# Altium schematic sheet Secondary_Protector.SchDoc: =SheetTitle
size A4; SheetTitle: Secondary Battery Protections; DrawnBy: Samyar Sadat Akhavi; SheetNumber: 4; SheetTotal: 5
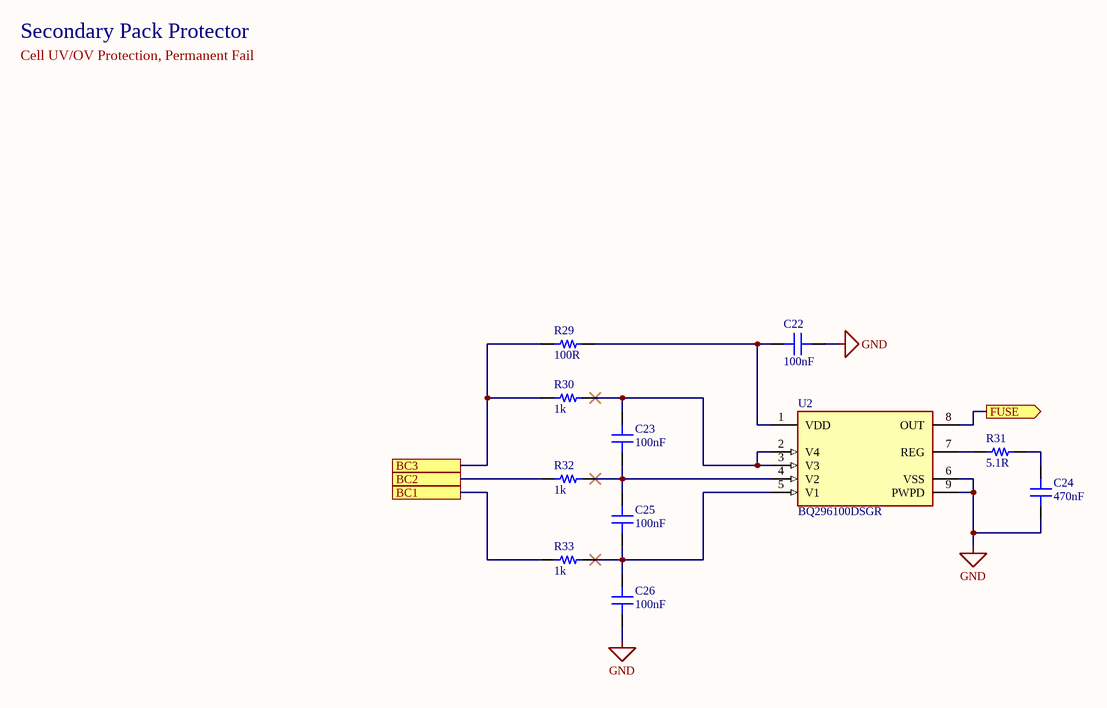
[diagram p0: Secondary_Protector.SchDoc]

## Parts
?  (no value)  (graphical)
C22  100nF  [CAP 0603_1608]
C23  100nF  [CAP 0603_1608]
C24  470nF  [CAP 0603_1608]
C25  100nF  [CAP 0603_1608]
C26  100nF  [CAP 0603_1608]
R29  100R  [RES 0603_1608]
R30  1k  [RES 0603_1608]
R31  5.1R  [RES 0603_1608]
R32  1k  [RES 0603_1608]
R33  1k  [RES 0603_1608]
U2  BQ296100DSGR  [DSG0008A]

## Ports
BC1 (see Pack_BMS_Module[2C], Battery_Management[1C], Cell_Connections[2B]), BC2 (see Pack_BMS_Module[2C], Battery_Management[1C], Cell_Connections[2B]), BC3 (see Pack_BMS_Module[2C], Battery_Management[1C], Cell_Connections[2B]), FUSE (out, see Pack_BMS_Module[2C], Battery_Management[3B])

## Nets
GND: C22.1 C24.1 C26.1 U2.6(VSS) U2.9(PWPD)
BC1: R33.1 ; port BC1
BC2: R32.1 ; port BC2
BC3: R29.2 R30.1 ; port BC3
FUSE: U2.8(OUT) ; port FUSE
NetC22_2: C22.2 R29.1 U2.1(VDD)
NetC23_1: C23.1 C25.2 R32.2 U2.4(V2)
NetC23_2: C23.2 R30.2 U2.2(V4) U2.3(V3)
NetC24_2: C24.2 R31.2
NetC25_1: C25.1 C26.2 R33.2 U2.5(V1)
NetR31_1: R31.1 U2.7(REG)

## Notes on the sheet
- Secondary Pack Protector
- Cell UV/OV Protection, Permanent Fail
- Sub-Project:
- Size:
- Drawn By:
- Revision:
- Date:
- File:
- Sheet:
- of

## Library data of the parts
? = SGR-STDTBSA4: STANDARD SCHEMATICS TITLE BLOCK
C22 C23 C25 C26 = GEN-CC100NT10V25KX7R603: GENERIC 0603 MLC CAPACITOR; Tolerance: ±10%; Voltage: 25V; Dielectric: X7R; Part Number: GEN-CC100NT10V25KX7R603; Value: 100nF
C24 = GEN-CC470NT10V16KX7R603: GENERIC 0603 MLC CAPACITOR; Tolerance: ±10%; Voltage: 16V; Dielectric: X7R; Part Number: GEN-CC470NT10V16KX7R603; Value: 470nF
R29 = GEN-CRR100T1P8603: GENERIC 0603 CHIP RESISTOR; Tolerance: ±1%; Power: 0.125W; Part Number: GEN-CRR100T1P8603; Value: 100R
R30 R32 R33 = GEN-CRR1KT1P8603: GENERIC 0603 CHIP RESISTOR; Tolerance: ±1%; Power: 0.125W; Part Number: GEN-CRR1KT1P8603; Value: 1k
R31 = GEN-CRR5R1T1P8603: GENERIC 0603 CHIP RESISTOR; Tolerance: ±1%; Power: 0.125W; Part Number: GEN-CRR5R1T1P8603; Value: 5.1R
U2 = BQ296100DSGR: IC BATT PROT LI-ION 2-4CEL 8WSON; Manufacturer: Texas Instruments; Part Number: BQ296100DSGR; Supplier 1: DigiKey; Supplier Part Number 1: 296-50964-1-ND